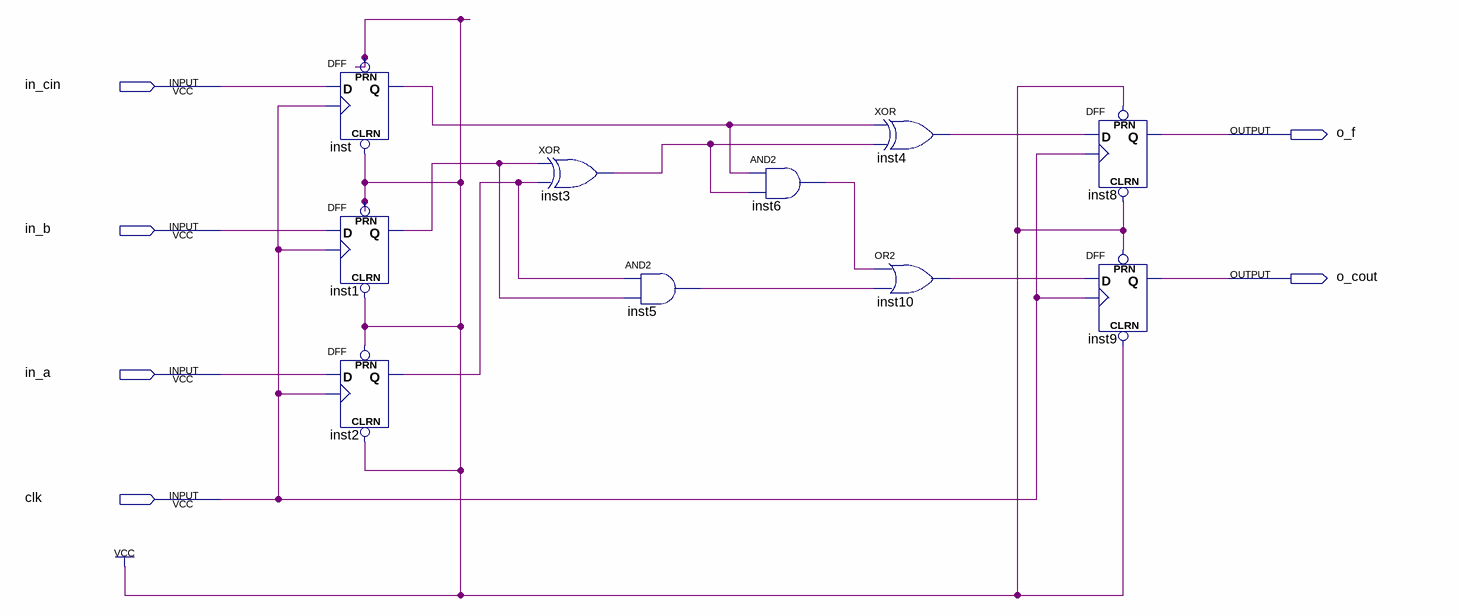
[diagram p0: schematic sheet]
// Quartus schematic FA_4B.bdf as structural Verilog: 10 symbols, 6 pins
module FA_4B (
  input  in_cin,
  input  in_b,
  input  in_a,
  input  clk,
  output o_f,
  output o_cout
);

  wire inst1_q, inst2_q, inst3_out, inst4_out, inst5_out, inst6_out, inst10_out, inst_q;

  DFF inst (.CLRN(1'b1), .CLK(clk), .D(in_cin), .PRN(1'b1), .Q(inst_q));
  DFF inst1 (.CLRN(1'b1), .CLK(clk), .D(in_b), .PRN(1'b1), .Q(inst1_q));
  DFF inst2 (.CLRN(1'b1), .CLK(clk), .D(in_a), .PRN(1'b1), .Q(inst2_q));
  xor inst3 (inst3_out, inst1_q, inst2_q);
  and inst5 (inst5_out, inst2_q, inst1_q);
  and inst6 (inst6_out, inst_q, inst3_out);
  xor inst4 (inst4_out, inst_q, inst3_out);
  or inst10 (inst10_out, inst6_out, inst5_out);
  DFF inst8 (.CLRN(1'b1), .CLK(clk), .D(inst4_out), .PRN(1'b1), .Q(o_f));
  DFF inst9 (.CLRN(1'b1), .CLK(clk), .D(inst10_out), .PRN(1'b1), .Q(o_cout));
endmodule
